# EAGLE design Nixie Uhr (EAGLE 6.1)
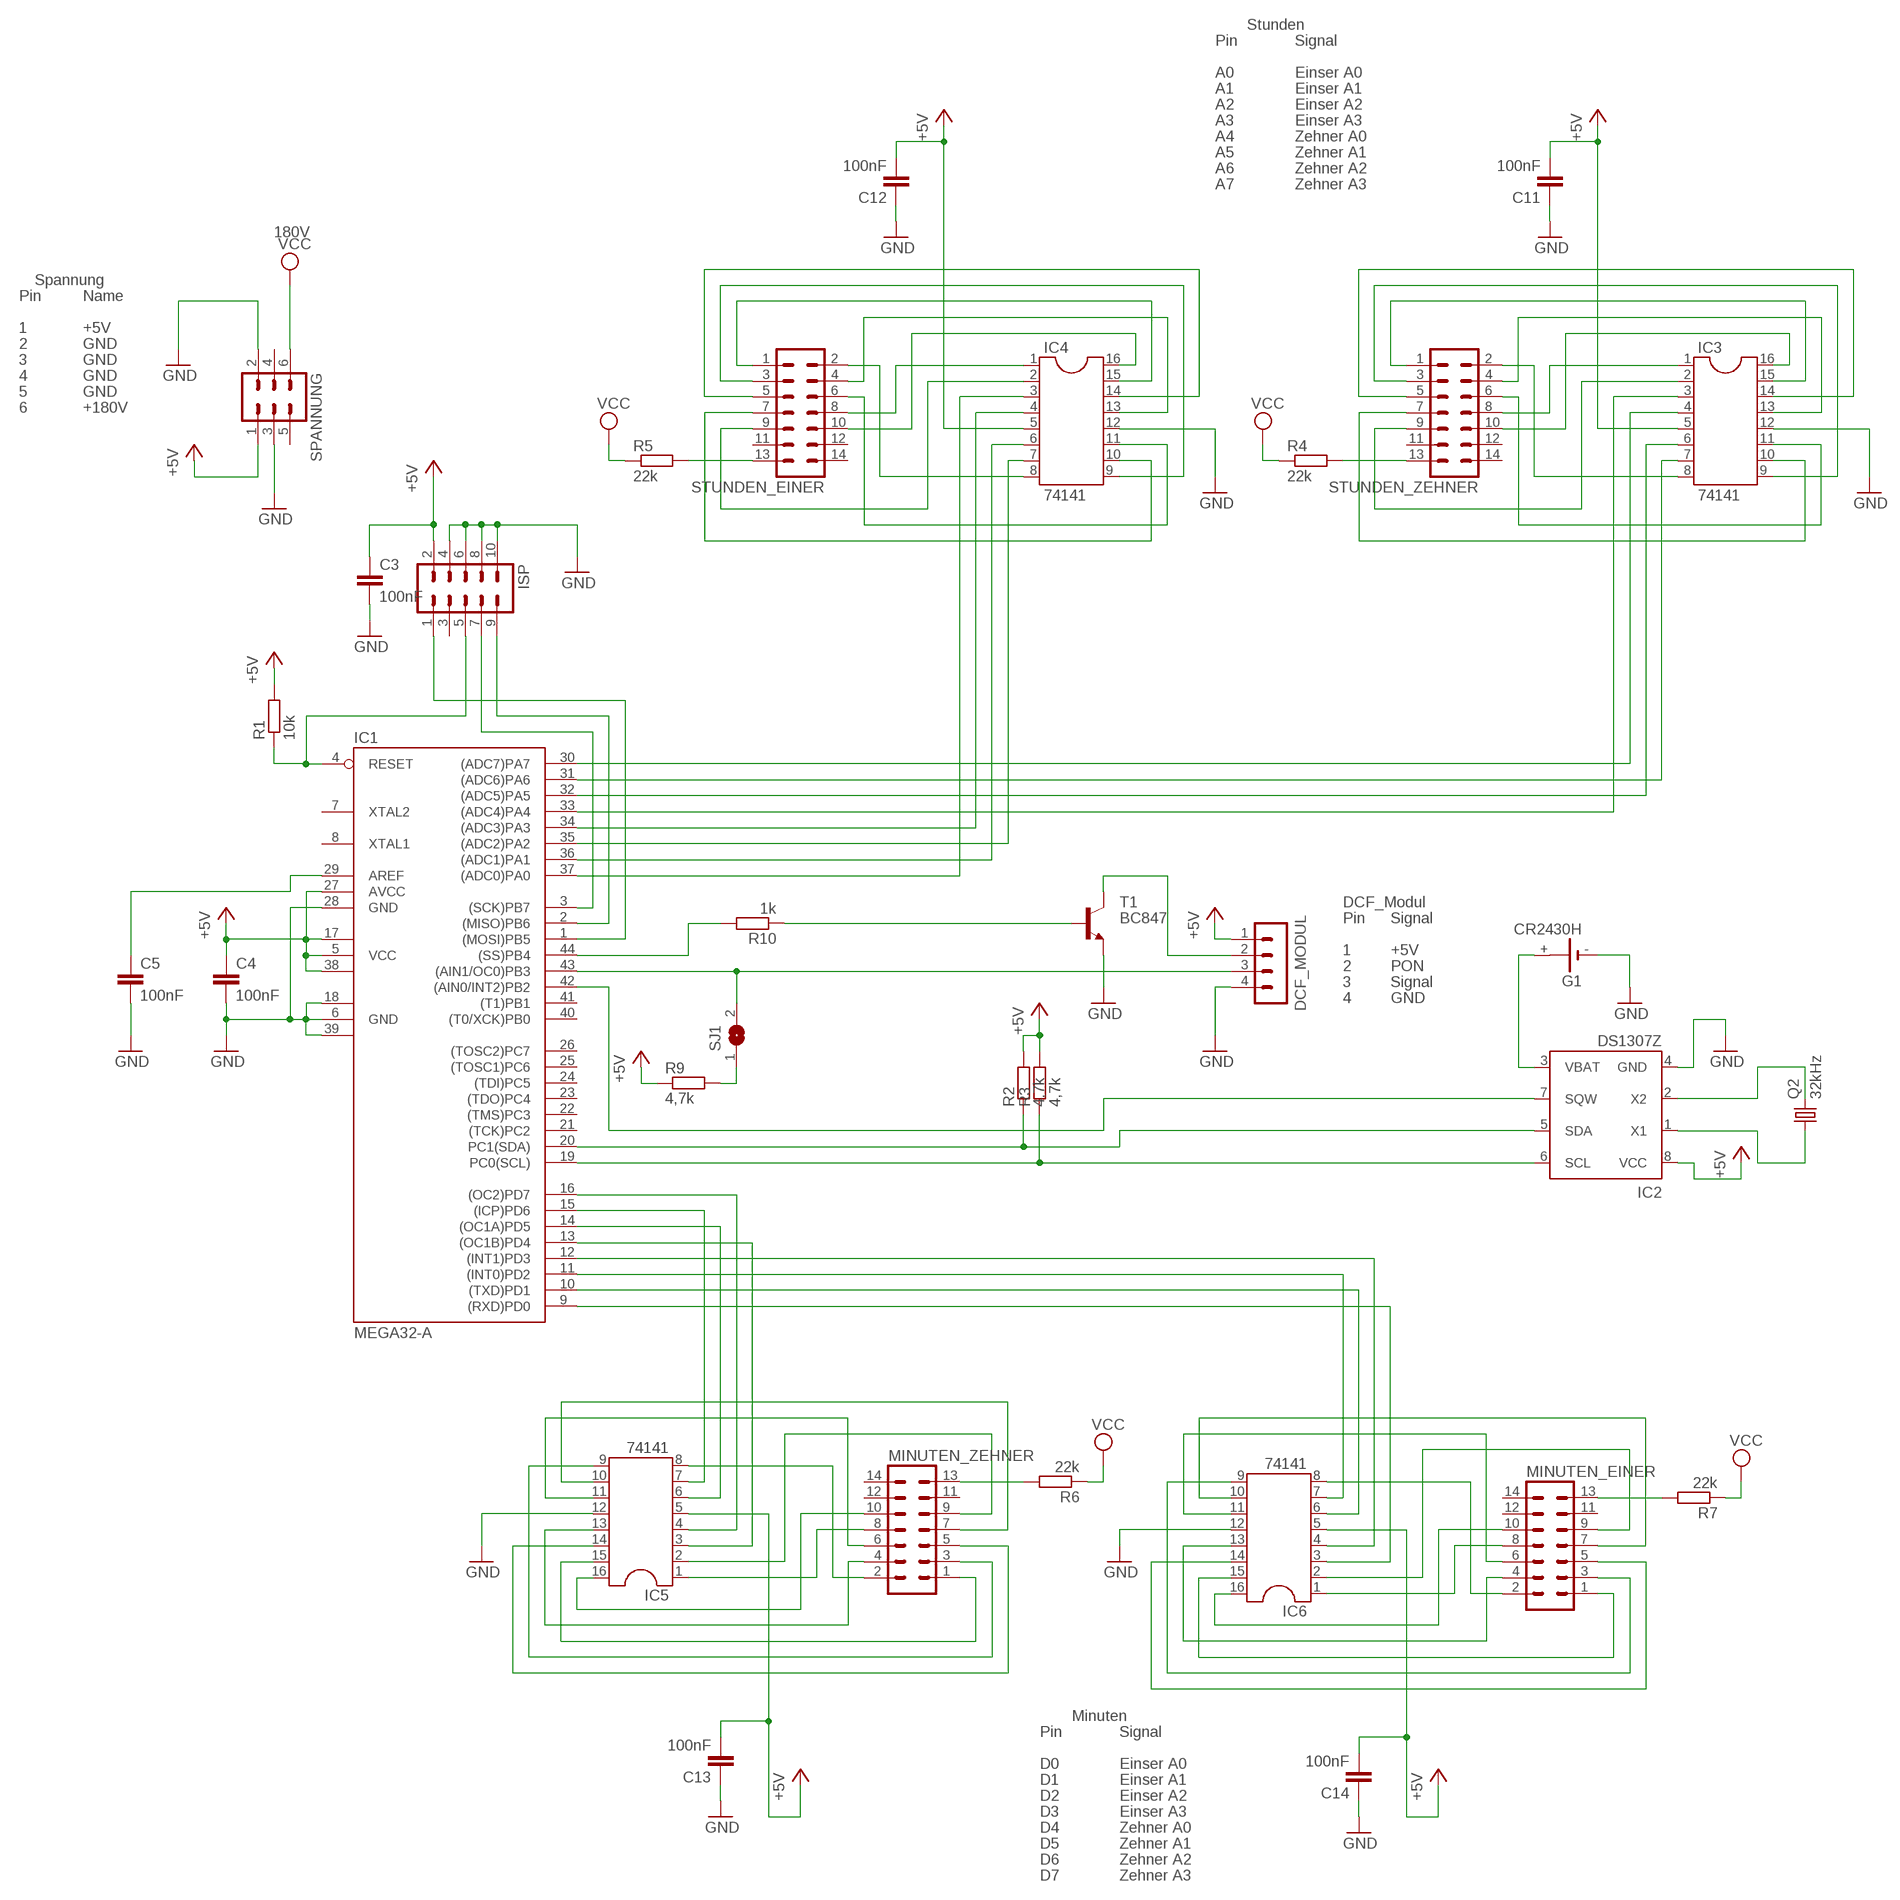
[diagram p0: schematic, sheet 1]

## Parts
C3  100nF  C-EUC0805  [C0805]
C4  100nF  C-EUC0805  [C0805]
C5  100nF  C-EUC0805  [C0805]
C11  100nF  C-EUC0805  [C0805]
C12  100nF  C-EUC0805  [C0805]
C13  100nF  C-EUC0805  [C0805]
C14  100nF  C-EUC0805  [C0805]
DCF_MODUL  MA04-1  [MA04-1]
G1  CR2430H  [CR2430H]
IC1  MEGA32-A  [TQFP44]
IC2  DS1307Z  [SOIC8]
IC3  74141  DIL16  [DIL16]
IC4  74141  DIL16  [DIL16]
IC5  74141  DIL16  [DIL16]
IC6  74141  DIL16  [DIL16]
ISP  ML10  [ML10]
MINUTEN_EINER  ML14  [ML14]
MINUTEN_ZEHNER  ML14  [ML14]
Q2  32kHz  CRYSTALTC26V  [TC26V]
R1  10k  R-EU_R0805  [R0805]
R2  4,7k  R-EU_R0805  [R0805]
R3  4,7k  R-EU_R0805  [R0805]
R4  22k  R-EU_0204/7  [0204/7]
R5  22k  R-EU_0204/7  [0204/7]
R6  22k  R-EU_0204/7  [0204/7]
R7  22k  R-EU_0204/7  [0204/7]
R9  4,7k  R-EU_R0805  [R0805]
R10  1k  R-EU_R0805  [R0805]
SJ1  SJ  [SJ]
SPANNUNG  ML6  [ML6]
STUNDEN_EINER  ML14  [ML14]
STUNDEN_ZEHNER  ML14  [ML14]
T1  BC847  [SOT23]

## Nets
+5V: C3.1 C4.1 C11.2 C12.2 C13.2 C14.2 DCF_MODUL.1 IC1.5(VCC) IC1.17(VCC1) IC1.27(AVCC) IC1.38(VCC2) IC2.8(VCC) IC3.5 IC4.5 IC5.5 IC6.5 ISP.2 R1.2 R2.2 R3.2 R9.1 SPANNUNG.1
DCF_SIGNAL: DCF_MODUL.3 IC1.43((AIN1/OC0)PB3) SJ1.2
GND: C3.2 C4.2 C5.2 C11.1 C12.1 C13.1 C14.1 DCF_MODUL.4 G1.- IC1.6(GND) IC1.18(GND1) IC1.28(GND) IC1.39(GND2) IC2.4(GND) IC3.12 IC4.12 IC5.12 IC6.12 ISP.4 ISP.6 ISP.8 ISP.10 SPANNUNG.2 SPANNUNG.3 T1.2(E)
MINUTEN_EINSER_A0: IC1.9((RXD)PD0) IC6.3
MINUTEN_MINUTEN_A1: IC1.10((TXD)PD1) IC6.6
MINUTEN_MINUTEN_A2: IC1.11((INT0)PD2) IC6.7
MINUTEN_MINUTEN_A3: IC1.12((INT1)PD3) IC6.4
MINUTEN_ZEHNER_A0: IC1.13((OC1B)PD4) IC5.3
MINUTEN_ZEHNER_A1: IC1.14((OC1A)PD5) IC5.6
MINUTEN_ZEHNER_A2: IC1.15((ICP)PD6) IC5.7
MINUTEN_ZEHNER_A3: IC1.16((OC2)PD7) IC5.4
MISO: IC1.2((MISO)PB6) ISP.9
MOSI: IC1.1((MOSI)PB5) ISP.1
N$3: IC3.15 STUNDEN_ZEHNER.1
N$4: R4.2 STUNDEN_ZEHNER.13
N$5: G1.+ IC2.3(VBAT)
N$6: IC1.42((AIN0/INT2)PB2) IC2.7(SQW)
N$7: IC2.2(X2) Q2.2
N$8: IC3.9 STUNDEN_ZEHNER.3
N$9: IC3.8 STUNDEN_ZEHNER.2
N$10: IC3.13 STUNDEN_ZEHNER.4
N$11: IC3.14 STUNDEN_ZEHNER.5
N$12: IC3.11 STUNDEN_ZEHNER.6
N$13: IC3.10 STUNDEN_ZEHNER.7
N$14: IC3.1 STUNDEN_ZEHNER.8
N$15: IC3.2 STUNDEN_ZEHNER.9
N$16: IC3.16 STUNDEN_ZEHNER.10
N$17: R5.2 STUNDEN_EINER.13
N$19: R9.2 SJ1.1
N$21: IC1.44((SS)PB4) R10.2
N$22: IC4.15 STUNDEN_EINER.1
N$23: IC4.9 STUNDEN_EINER.3
N$24: IC4.8 STUNDEN_EINER.2
N$25: IC4.13 STUNDEN_EINER.4
N$26: IC4.14 STUNDEN_EINER.5
N$27: IC4.11 STUNDEN_EINER.6
N$28: IC4.10 STUNDEN_EINER.7
N$29: IC4.1 STUNDEN_EINER.8
N$30: IC4.2 STUNDEN_EINER.9
N$31: IC4.16 STUNDEN_EINER.10
N$32: R10.1 T1.1(B)
N$33: C5.1 IC1.29(AREF)
N$34: DCF_MODUL.2 T1.3(C)
N$36: MINUTEN_ZEHNER.13 R6.2
N$37: IC5.15 MINUTEN_ZEHNER.1
N$38: IC5.9 MINUTEN_ZEHNER.3
N$39: IC5.8 MINUTEN_ZEHNER.2
N$40: IC5.13 MINUTEN_ZEHNER.4
N$41: IC5.14 MINUTEN_ZEHNER.5
N$42: IC5.11 MINUTEN_ZEHNER.6
N$43: IC5.10 MINUTEN_ZEHNER.7
N$44: IC5.1 MINUTEN_ZEHNER.8
N$45: IC5.2 MINUTEN_ZEHNER.9
N$46: IC5.16 MINUTEN_ZEHNER.10
N$51: MINUTEN_EINER.13 R7.2
N$52: IC6.15 MINUTEN_EINER.1
N$53: IC6.9 MINUTEN_EINER.3
N$54: IC6.8 MINUTEN_EINER.2
N$55: IC6.13 MINUTEN_EINER.4
N$56: IC6.14 MINUTEN_EINER.5
N$57: IC6.11 MINUTEN_EINER.6
N$58: IC6.10 MINUTEN_EINER.7
N$59: IC6.1 MINUTEN_EINER.8
N$60: IC6.2 MINUTEN_EINER.9
N$61: IC6.16 MINUTEN_EINER.10
N$66: IC2.1(X1) Q2.1
RESET: IC1.4(RESET) ISP.5 R1.1
SCK: IC1.3((SCK)PB7) ISP.7
SCL: IC1.19(PC0(SCL)) IC2.6(SCL) R3.1
SDA: IC1.20(PC1(SDA)) IC2.5(SDA) R2.1
STUNDEN_EINER_A0: IC1.37((ADC0)PA0) IC4.3
STUNDEN_EINER_A1: IC1.36((ADC1)PA1) IC4.6
STUNDEN_EINER_A2: IC1.35((ADC2)PA2) IC4.7
STUNDEN_EINER_A3: IC1.34((ADC3)PA3) IC4.4
STUNDEN_ZEHNER_A0: IC1.33((ADC4)PA4) IC3.3
STUNDEN_ZEHNER_A1: IC1.32((ADC5)PA5) IC3.6
STUNDEN_ZEHNER_A2: IC1.31((ADC6)PA6) IC3.7
STUNDEN_ZEHNER_A3: IC1.30((ADC7)PA7) IC3.4
VCC: R4.1 R5.1 R6.1 R7.1 SPANNUNG.6
Unconnected: G1.+@1(+) IC1.7(XTAL2) IC1.8(XTAL1) IC1.21((TCK)PC2) IC1.22((TMS)PC3) IC1.23((TDO)PC4) IC1.24((TDI)PC5) IC1.25((TOSC1)PC6) IC1.26((TOSC2)PC7) IC1.40((T0/XCK)PB0) IC1.41((T1)PB1) ISP.3 MINUTEN_EINER.11 MINUTEN_EINER.12 MINUTEN_EINER.14 MINUTEN_ZEHNER.11 MINUTEN_ZEHNER.12 MINUTEN_ZEHNER.14 SPANNUNG.4 SPANNUNG.5 STUNDEN_EINER.11 STUNDEN_EINER.12 STUNDEN_EINER.14 STUNDEN_ZEHNER.11 STUNDEN_ZEHNER.12 STUNDEN_ZEHNER.14

## Notes on the sheet
- Stunden
- Pin | Signal
- A0 | Einser A0
- A1 | Einser A1
- A2 | Einser A2
- A3 | Einser A3
- A4 | Zehner A0
- A5 | Zehner A1
- A6 | Zehner A2
- A7 | Zehner A3
- 180V
- Spannung
- Pin | Name
- 1 | +5V
- 2 | GND
- 3 | GND
- 4 | GND
- 5 | GND
- 6 | +180V
- DCF_Modul
- Pin | Signal
- 1 | +5V
- 2 | PON
- 3 | Signal
- 4 | GND
- Minuten
- Pin | Signal
- D0 | Einser A0
- D1 | Einser A1
- D2 | Einser A2
- D3 | Einser A3
- D4 | Zehner A0
- D5 | Zehner A1
- D6 | Zehner A2
- D7 | Zehner A3

## Library data of the parts
C3-C5 C11-C14 = rcl:C-EU: CAPACITOR, European symbol
DCF_MODUL = con-lstb:MA04-1: PIN HEADER; OC_FARNELL: unknown; OC_NEWARK: unknown
G1 = battery:CR2430H: LI BATTERY Varta
IC1 = atmel:MEGA32: MICROCONTROLLER 32 Kbytes FLASH 2 Kbytes SRAM 1 Kbytes EEPROM USART 8-channel 10 bit ADC Source: www.atmel.com .. doc2503.pdf; MPN: ATMEGA32-16AU; OC_FARNELL: 9171274; OC_NEWARK: 69K6677
IC2 = ds1307_pcf8583:DS1307: I2C-Bus CLOCK/CALENDAR
IC3-IC6 = ic-package:DIL16: Dual In Line / Socket
ISP = con-harting-ml:ML10: HARTING; OC_FARNELL: unknown; OC_NEWARK: unknown
MINUTEN_EINER MINUTEN_ZEHNER STUNDEN_EINER STUNDEN_ZEHNER = con-harting-ml:ML14: HARTING; OC_FARNELL: unknown; OC_NEWARK: unknown
Q2 = crystal:CRYSTAL: CRYSTAL; OC_FARNELL: unknown; OC_NEWARK: unknown
R1-R7 R9 R10 = rcl:R-EU_: RESISTOR, European symbol
SJ1 = jumper:SJ: SMD solder JUMPER
SPANNUNG = con-harting-ml:ML6: HARTING; OC_FARNELL: unknown; OC_NEWARK: unknown
T1 = transistor:BC847: NPN TRANSISTOR

## Board
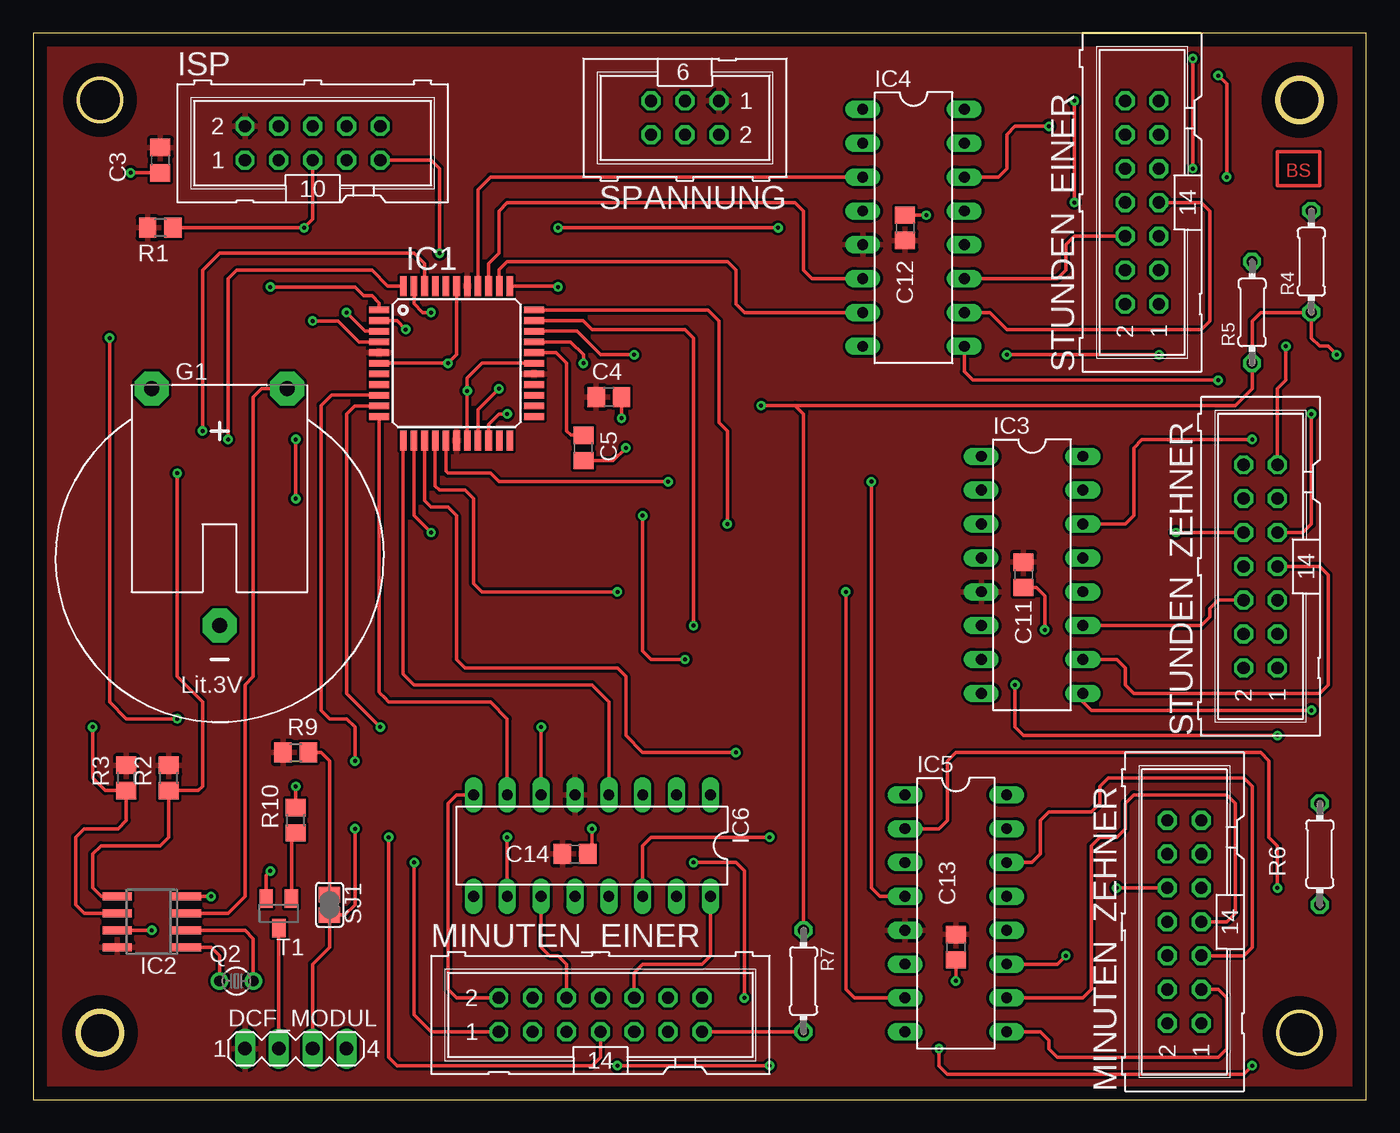
[diagram p1: board, top side]
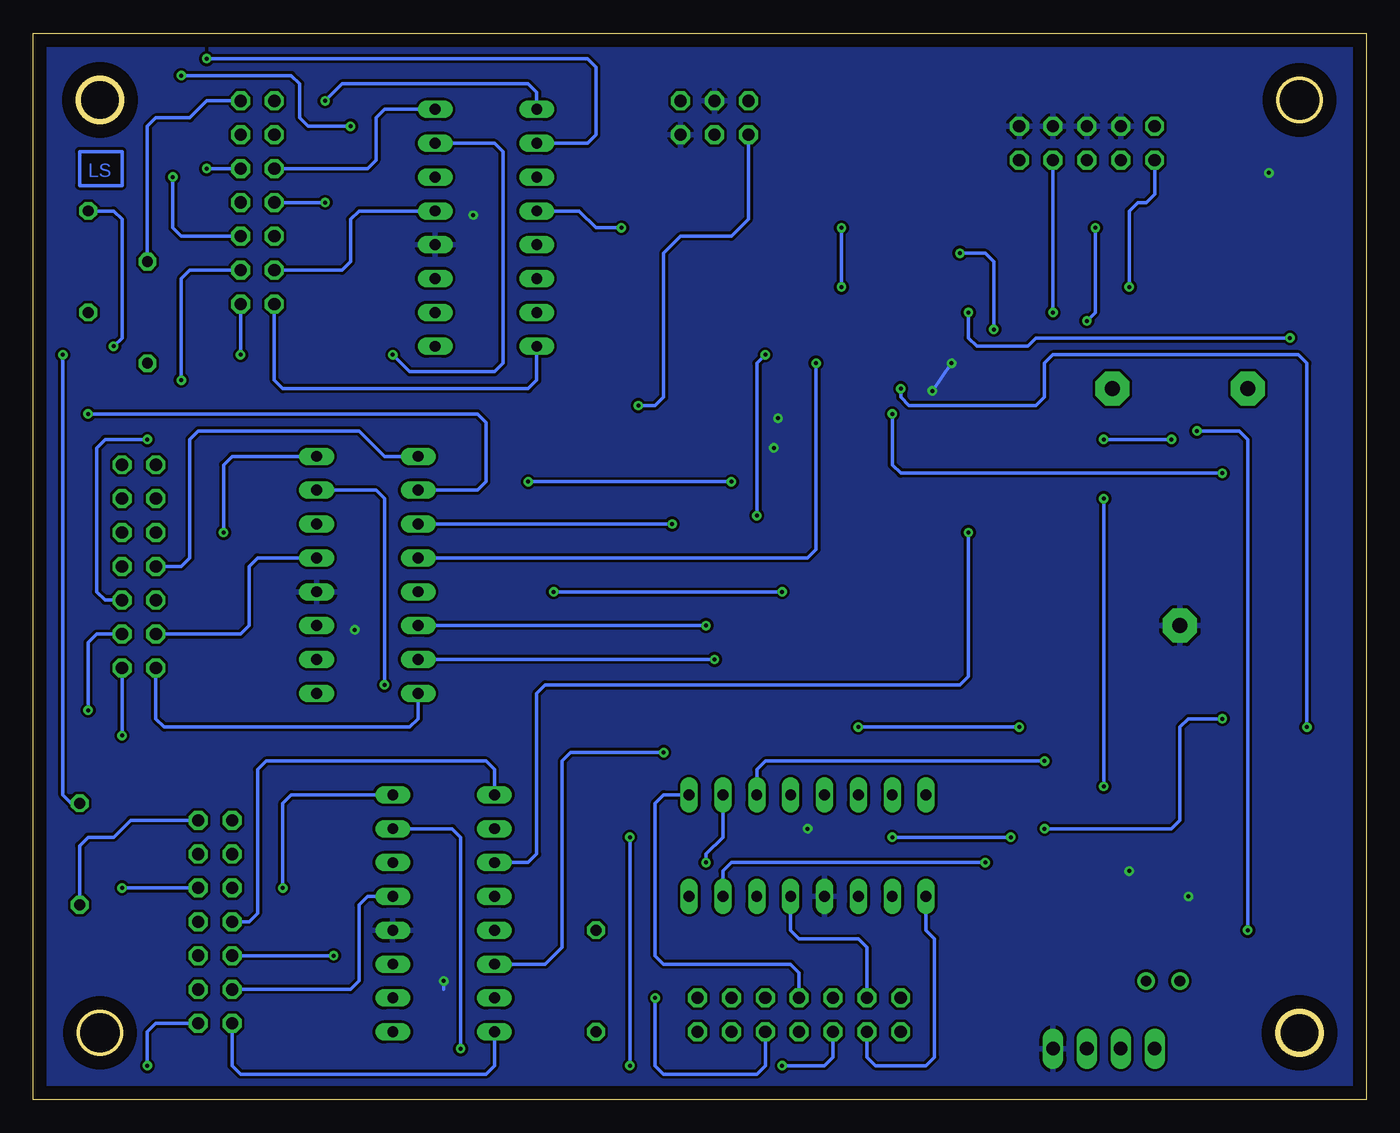
[diagram p2: board, bottom side, seen from below]

Size 100 x 80 mm. Coordinates in mm from the lower left corner, seen from the top.
Outline: 0,0 100,0 100,80 0,80 0,0
Outline: circle at 95,5 radius 1.6
Outline: circle at 5,75 radius 1.6
Outline: circle at 95,75 radius 1.6
Outline: circle at 5,5 radius 1.6
Copper layers (1*16): Top 0.035mm / dielectric 1.5mm / Bottom 0.035mm
Design rules: minimum track width 10mil, minimum drill 24mil, track to track 8mil, track to pad 8mil, pad to pad 8mil, via to via 8mil, smd to smd 8mil, copper to edge 40mil, drill to drill 8mil, minimum pad ring 10mil, minimum via ring 8mil, stop-mask expansion 4mil, vias tented up to drill 0mil, thermal gap 10mil

### Footprints (pad centres in the part's own frame; a part is rotated, then mirrored left to right if it is on the bottom)
C0805 = smd 1.3 x 1.5: 1 -0.95,0; 2 0.95,0
MA04-1 = drill 1.016 long: 1 -3.81,0; 2 -1.27,0; 3 1.27,0; 4 3.81,0
CR2430H = drill 1.118 pad 2.54 octagon: + 5.08,12.7; +@1 -5.08,12.7; - 0,-5.08
TQFP44 = smd 1.5 x 0.5: 1 -5.8,4; 2 -5.8,3.2; 3 -5.8,2.4; 4 -5.8,1.6; 5 -5.8,0.8; 6 -5.8,0; 7 -5.8,-0.8; 8 -5.8,-1.6; 9 -5.8,-2.4; 10 -5.8,-3.2; 11 -5.8,-4; 23 5.8,-4; 24 5.8,-3.2; 25 5.8,-2.4; 26 5.8,-1.6; 27 5.8,-0.8; 28 5.8,0; 29 5.8,0.8; 30 5.8,1.6; 31 5.8,2.4; 32 5.8,3.2; 33 5.8,4 | smd 0.5 x 1.5: 12 -4,-5.8; 13 -3.2,-5.8; 14 -2.4,-5.8; 15 -1.6,-5.8; 16 -0.8,-5.8; 17 0,-5.8; 18 0.8,-5.8; 19 1.6,-5.8; 20 2.4,-5.8; 21 3.2,-5.8; 22 4,-5.8; 34 4,5.8; 35 3.2,5.8; 36 2.4,5.8; 37 1.6,5.8; 38 0.8,5.8; 39 0,5.8; 40 -0.8,5.8; 41 -1.6,5.8; 42 -2.4,5.8; 43 -3.2,5.8; 44 -4,5.8
SOIC8 = smd 0.6 x 2.2: 1 -1.905,-2.6; 2 -0.635,-2.6; 3 0.635,-2.6; 4 1.905,-2.6; 5 1.905,2.6; 6 0.635,2.6; 7 -0.635,2.6; 8 -1.905,2.6
DIL16 = drill 0.813 long: 1 -8.89,-3.81; 2 -6.35,-3.81; 3 -3.81,-3.81; 4 -1.27,-3.81; 5 1.27,-3.81; 6 3.81,-3.81; 7 6.35,-3.81; 8 8.89,-3.81; 9 8.89,3.81; 10 6.35,3.81; 11 3.81,3.81; 12 1.27,3.81; 13 -1.27,3.81; 14 -3.81,3.81; 15 -6.35,3.81; 16 -8.89,3.81
ML10 = drill 0.914 octagon: 1 -5.08,-1.27; 2 -5.08,1.27; 3 -2.54,-1.27; 4 -2.54,1.27; 5 0,-1.27; 6 0,1.27; 7 2.54,-1.27; 8 2.54,1.27; 9 5.08,-1.27; 10 5.08,1.27
ML14 = drill 0.914 octagon: 1 -7.62,-1.27; 2 -7.62,1.27; 3 -5.08,-1.27; 4 -5.08,1.27; 5 -2.54,-1.27; 6 -2.54,1.27; 7 0,-1.27; 8 0,1.27; 9 2.54,-1.27; 10 2.54,1.27; 11 5.08,-1.27; 12 5.08,1.27; 13 7.62,-1.27; 14 7.62,1.27
TC26V = drill 0.813: 1 -1.27,0; 2 1.27,0
R0805 = smd 1.3 x 1.5: 1 -0.95,0; 2 0.95,0
0204/7 = drill 0.813 octagon: 1 -3.81,0; 2 3.81,0
SJ = smd 1.168 x 1.6: 1 -0.762,0; 2 0.762,0
ML6 = drill 0.914 octagon: 1 -2.54,-1.27; 2 -2.54,1.27; 3 0,-1.27; 4 0,1.27; 5 2.54,-1.27; 6 2.54,1.27
SOT23 = smd 1 x 1.4: 1 -0.95,-1.1; 2 0.95,-1.1; 3 0,1.1

### Placement (x,y rotation side)
C3  9.53,70.48 270 top
C4  43.18,52.7 0 top
C5  41.27,48.9 270 top
C11  74.3,39.37 90 top
C12  65.41,65.41 270 top
C13  69.22,11.43 90 top
C14  40.64,18.41 180 top
DCF_MODUL  19.68,3.81 0 top
G1  13.97,40.64 0 top
IC1  31.75,55.24 0 top
IC2  8.89,13.34 90 top
IC3  74.93,39.37 270 top
IC4  66.04,65.41 270 top
IC5  69.22,13.97 270 top
IC6  41.91,19.05 180 top
ISP  20.95,71.75 0 top
MINUTEN_EINER  42.55,6.35 0 top
MINUTEN_ZEHNER  86.36,13.34 90 top
Q2  15.24,8.89 0 top
R1  9.53,65.41 180 top
R2  10.16,24.13 90 top
R3  6.99,24.13 90 top
R4  95.89,62.87 90 top
R5  91.44,59.05 90 top
R6  96.52,18.41 270 top
R7  57.78,8.89 270 top
R9  19.68,26.04 0 top
R10  19.68,20.95 90 top
SJ1  22.23,14.61 270 top
SPANNUNG  48.9,73.66 180 top
STUNDEN_EINER  83.19,67.31 90 top
STUNDEN_ZEHNER  92.08,40.01 90 top
T1  18.41,13.97 180 top

### Tracks (layer width: path | path; a pad name or v marks a point on that pad's centre or on a via)
+5V
  pour Top: -10.16,91.44 110.49,91.44 110.49,-15.24 -10.16,-15.24
DCF_SIGNAL  (via drill 0.3)
  Top 0.254: DCF_MODUL.3 20.95,10.16 22.23,11.43 SJ1.2 | SJ1.2 22.23,13.97 | IC1.43 28.55,59.72 29.21,59.05 v29.84,59.05 | v5.71,57.15 5.71,29.84 6.99,28.57 v10.79,28.57 | v24.13,20.32 24.13,14.61 23.37,13.84 SJ1.2
  Bottom 0.254: v29.84,59.05 29.84,57.15 29.21,56.52 25.4,56.52 24.77,57.15 v5.71,57.15 | v24.13,20.32 14.61,20.32 13.97,20.95 13.97,27.94 13.34,28.57 v10.79,28.57
GND  (via drill 0.3)
  Top 0.254: IC1.39 31.75,55.88 v31.11,55.24 IC1.6 25.4,55.24 | IC1.18 v32.55,53.17 32.55,54.14 33.66,55.24 IC1.28 | C3.2 v7.3,69.53 | C12.1 v67,66.36 | C11.1 75.25,38.42 75.89,37.78 v75.89,35.24 | C5.2 43.5,47.95 v44.45,48.9 | C4.2 v44.13,51.12 | C13.1 v69.22,8.89 | T1.2 17.46,16.82 v17.78,17.14 | IC2.4 v13.34,15.24 | v41.91,20.32 41.91,18.41
  Top 0.406: C14.1 41.91,18.41
  Bottom 0.254: v32.55,53.17 v31.11,55.24 | v69.22,8.89 69.22,8.26
  pour Bottom: -8.89,87.63 109.22,87.63 109.22,-12.7 -8.89,-12.7
MINUTEN_EINSER_A0  (via drill 0.3)
  Top 0.254: IC1.9 22.36,52.84 21.59,52.07 21.59,29.21 22.23,28.57 23.5,28.57 24.13,27.94 v24.13,25.4
  Bottom 0.254: v24.13,25.4 45.09,25.4 45.72,24.77 IC6.3
MINUTEN_MINUTEN_A1  (via drill 0.3)
  Top 0.254: IC1.10 24.11,52.05 23.5,51.44 23.5,30.48 v26.04,27.94 | v38.1,27.94 IC6.6
  Bottom 0.254: v26.04,27.94 v38.1,27.94
MINUTEN_MINUTEN_A2
  Top 0.254: IC6.7 35.56,28.57 34.29,29.84 26.67,29.84 26.35,30.16 26.04,30.48 25.95,30.57 IC1.11
MINUTEN_MINUTEN_A3
  Top 0.254: IC6.4 43.18,29.84 41.91,31.11 28.57,31.11 27.75,31.94 IC1.12
MINUTEN_ZEHNER_A0  (via drill 0.3)
  Top 0.254: v29.84,42.55 28.57,43.81 28.57,49.53
  Top 0.406: 28.57,49.53 28.55,49.53 IC1.13
  Bottom 0.254: IC5.3 62.87,17.78 62.23,18.41 62.23,30.48 61.59,31.11 30.48,31.11 29.84,31.75 v29.84,42.55
MINUTEN_ZEHNER_A1  (via drill 0.3)
  Top 0.254: IC1.14 29.35,44.95 29.84,44.45 31.11,44.45 31.75,43.81 31.75,33.02 32.38,32.38 43.81,32.38 44.45,31.75 44.45,27.3 45.72,26.04 v52.7,26.04
  Bottom 0.254: v52.7,26.04 59.69,26.04 60.33,25.4 60.33,11.43 61.59,10.16 IC5.6
MINUTEN_ZEHNER_A2  (via drill 0.3)
  Top 0.254: IC5.7 61.59,7.62 60.96,8.26 v60.96,38.1 | v43.81,38.1 33.66,38.1 33.02,38.73 33.02,45.09 32.38,45.72 30.48,45.72 30.15,46.05 IC1.15
  Bottom 0.254: v60.96,38.1 v43.81,38.1
MINUTEN_ZEHNER_A3  (via drill 0.3)
  Top 0.254: IC5.4 63.5,15.24 62.87,15.88 v62.87,46.35 | IC1.16 30.95,47.16 31.11,46.99 34.29,46.99 34.92,46.35 v47.62,46.35
  Bottom 0.254: v62.87,46.35 v47.62,46.35
MISO  (via drill 0.3)
  Top 0.254: IC1.2 27.28,58.45 v27.94,57.78 | v30.48,63.5 30.48,69.85 29.84,70.48 ISP.9
  Bottom 0.254: v27.94,57.78 27.94,62.87 28.57,63.5 v30.48,63.5
MOSI  (via drill 0.3)
  Top 0.254: IC1.1 25.95,59.77 25.4,60.33 24.77,60.33 24.13,60.96 v17.78,60.96
  Bottom 0.254: v17.78,60.96 17.78,66.67 17.14,67.31 16.51,67.31 15.88,67.94 ISP.1
N$3  (via drill 0.3)
  Top 0.254: v93.34,27.3 74.3,27.3 73.66,27.94 v73.66,31.11
  Bottom 0.254: v73.66,31.11 73.66,45.09 74.3,45.72 IC3.15 | v93.34,27.3 STUNDEN_ZEHNER.1
N$4  (via drill 0.3)
  Top 0.254: v93.98,56.52 93.98,53.98 93.34,53.34 STUNDEN_ZEHNER.13
  Bottom 0.254: R4.2 93.98,66.67 93.34,66.04 93.34,57.15 v93.98,56.52
N$5
  Top 0.254: IC2.3 14.61,13.97 15.88,15.24 15.88,31.11 16.51,31.75 16.51,52.7 17.14,53.34 G1.+
N$6  (via drill 0.3)
  Top 0.254: IC2.7 v8.89,12.7 | v12.7,50.16 12.7,62.23 13.97,63.5 28.57,63.5 29.35,62.73 IC1.42
  Bottom 0.254: v8.89,12.7 8.89,49.53 9.53,50.16 v12.7,50.16
N$7
  Top 0.254: IC2.2 15.88,12.7 16.51,12.06 Q2.2
N$8  (via drill 0.3)
  Top 0.254: IC3.9 78.74,29.84 79.38,29.21 v95.89,29.21
  Bottom 0.254: v95.89,29.21 95.89,34.29 95.25,34.92 STUNDEN_ZEHNER.3
N$9
  Bottom 0.254: IC3.8 71.12,28.57 71.75,27.94 90.17,27.94 90.81,28.57 STUNDEN_ZEHNER.2
N$10
  Bottom 0.254: STUNDEN_ZEHNER.4 84.45,34.92 83.82,35.56 83.82,40.01 83.19,40.64 IC3.13
N$11  (via drill 0.3)
  Top 0.254: IC3.14 81.92,43.18 82.55,43.81 82.55,48.9 83.19,49.53 v91.44,49.53
  Bottom 0.254: v91.44,49.53 94.61,49.53 95.25,48.9 95.25,38.1 94.61,37.47 STUNDEN_ZEHNER.5
N$12
  Top 0.254: IC3.11 87.63,35.56 88.27,36.2 88.27,36.83 88.9,37.47 STUNDEN_ZEHNER.6
N$13
  Top 0.254: IC3.10 81.28,33.02 81.92,32.38 81.92,31.11 82.55,30.48 96.52,30.48 97.16,31.11 97.16,39.37 96.52,40.01 STUNDEN_ZEHNER.7
N$14
  Bottom 0.254: IC3.1 73.66,48.26 75.56,50.16 87.63,50.16 88.27,49.53 88.27,40.64 88.9,40.01 STUNDEN_ZEHNER.8
N$15  (via drill 0.3)
  Top 0.254: v95.89,51.44 95.89,43.18 95.25,42.55 STUNDEN_ZEHNER.9
  Bottom 0.254: IC3.2 66.67,45.72 66.04,46.35 66.04,50.8 66.67,51.44 v95.89,51.44
N$16  (via drill 0.3)
  Top 0.254: v85.72,42.55 STUNDEN_ZEHNER.10
  Bottom 0.254: IC3.16 85.09,48.26 85.72,47.62 v85.72,42.55
N$17
  Bottom 0.254: STUNDEN_EINER.13 87,74.93 88.27,73.66 90.81,73.66 91.44,73.03 R5.2
N$18
  Top 0.254: 93.34,71.12 96.52,71.12 96.52,68.58 93.34,68.58 93.34,71.12
N$19
  Top 0.254: R9.2 21.59,26.04 22.23,25.4 SJ1.1
  Top 0.406: 22.23,15.24 SJ1.1
N$20
  Bottom 0.254: 93.34,71.12 96.52,71.12 96.52,68.58 93.34,68.58 93.34,71.12
N$21  (via drill 0.3)
  Top 0.254: R10.2 v19.68,23.5 | v19.68,45.09 v19.68,49.53 | v14.61,49.53 14.61,61.59 15.24,62.23 25.4,62.23 26.59,61.05 IC1.44
  Bottom 0.254: v19.68,23.5 v19.68,45.09 | v19.68,49.53 v14.61,49.53
N$22  (via drill 0.3)
  Top 0.254: v84.45,55.88 v73.03,55.88
  Bottom 0.254: STUNDEN_EINER.1 v84.45,55.88 | v73.03,55.88 71.75,54.61 65.41,54.61 64.77,55.24 64.77,71.12 65.41,71.75 IC4.15
N$23  (via drill 0.3)
  Top 0.254: IC4.9 69.85,54.61 70.48,53.98 v88.9,53.98
  Bottom 0.254: v88.9,53.98 88.9,61.59 88.27,62.23 STUNDEN_EINER.3
N$24
  Bottom 0.254: IC4.8 62.23,53.98 62.87,53.34 81.28,53.34 81.92,53.98 STUNDEN_EINER.2
N$25
  Bottom 0.254: IC4.13 75.56,66.67 76.2,66.04 76.2,62.87 76.83,62.23 STUNDEN_EINER.4
N$26  (via drill 0.3)
  Top 0.254: IC4.14 72.39,69.22 73.03,69.85 73.03,72.39 73.66,73.03 v76.2,73.03 | v88.9,76.83 89.53,76.2 v89.53,69.22
  Bottom 0.254: v76.2,73.03 79.38,73.03 80.01,73.66 80.01,76.2 80.64,76.83 v88.9,76.83 | STUNDEN_EINER.5 88.9,64.77 89.53,65.41 v89.53,69.22
N$27
  Top 0.254: IC4.11 76.83,61.59 77.47,62.23 77.47,64.14 78.11,64.77 STUNDEN_EINER.6
N$28
  Top 0.254: IC4.10 71.75,59.05 73.03,57.78 87.63,57.78 88.27,58.42 88.27,66.67 87.63,67.31 STUNDEN_EINER.7
N$29  (via drill 0.3)
  Top 0.254: v78.11,74.93 v78.11,67.31
  Bottom 0.254: IC4.1 62.23,75.56 62.87,76.2 76.83,76.2 v78.11,74.93 | v78.11,67.31 STUNDEN_EINER.8
N$30  (via drill 0.3)
  Top 0.254: v87,78.11 v87,69.85
  Bottom 0.254: IC4.2 58.42,71.75 57.78,72.39 57.78,77.47 58.42,78.11 v87,78.11 | v87,69.85 STUNDEN_EINER.9
N$31
  Bottom 0.254: IC4.16 73.66,74.3 74.3,73.66 74.3,70.48 74.93,69.85 STUNDEN_EINER.10
N$32
  Top 0.254: T1.1 19.36,19.69 R10.1
N$33
  Top 0.254: IC1.29 39.2,56.05 40.01,55.24 40.01,50.16 40.33,49.84 C5.1
N$34
  Top 0.254: T1.3 DCF_MODUL.2
N$36
  Bottom 0.254: MINUTEN_ZEHNER.13 92.71,20.95 93.98,19.68 95.89,19.68 96.52,19.05 R6.2
N$37  (via drill 0.3)
  Top 0.254: v91.44,2.54 90.81,1.91 68.58,1.91 67.94,2.54 v67.94,3.81
  Bottom 0.254: IC5.15 68.58,20.32 67.94,19.68 v67.94,3.81 | v91.44,2.54 91.44,5.08 90.81,5.71 MINUTEN_ZEHNER.1
N$38
  Top 0.254: IC5.9 75.56,5.08 76.2,4.45 76.2,3.81 76.83,3.17 88.9,3.17 89.53,3.81 89.53,7.62 88.9,8.26 MINUTEN_ZEHNER.3
N$39
  Bottom 0.254: IC5.8 65.41,2.54 66.04,1.91 84.45,1.91 85.09,2.54 MINUTEN_ZEHNER.2
N$40
  Bottom 0.254: IC5.13 74.93,15.24 75.56,14.61 75.56,8.89 76.2,8.26 MINUTEN_ZEHNER.4
N$41
  Top 0.254: IC5.14 74.93,17.78 75.56,18.41 75.56,20.95 76.2,21.59 79.38,21.59 80.01,22.23 80.01,23.5 80.64,24.13 90.81,24.13 91.44,23.5 91.44,11.43 90.81,10.79 MINUTEN_ZEHNER.5
N$42  (via drill 0.3)
  Top 0.254: IC5.11 76.83,10.16 v77.47,10.79
  Bottom 0.254: v77.47,10.79 MINUTEN_ZEHNER.6
N$43
  Top 0.254: IC5.10 78.74,7.62 79.38,8.26 79.38,19.05 80.01,19.68 81.28,19.68 81.92,20.32 81.92,22.23 82.55,22.86 89.53,22.86 90.17,22.23 90.17,13.97 89.53,13.34 MINUTEN_ZEHNER.7
N$44
  Bottom 0.254: IC5.1 65.41,24.77 66.04,25.4 82.55,25.4 83.19,24.77 83.19,13.97 83.82,13.34 MINUTEN_ZEHNER.8
N$45  (via drill 0.3)
  Top 0.254: v93.34,15.88 93.34,19.05 92.71,19.68 92.71,25.4 92.08,26.04 69.22,26.04 68.58,25.4 68.58,20.95 67.94,20.32 IC5.2
  Bottom 0.254: v93.34,15.88 MINUTEN_ZEHNER.9
N$46  (via drill 0.3)
  Top 0.254: v81.28,15.88 MINUTEN_ZEHNER.10
  Bottom 0.254: v81.28,15.88 81.28,22.23 80.64,22.86 IC5.16
N$51
  Top 0.254: R7.2 MINUTEN_EINER.13
N$52  (via drill 0.3)
  Top 0.254: MINUTEN_EINER.1 29.84,5.08 28.57,6.35 v28.57,17.78
  Bottom 0.254: v28.57,17.78 47.62,17.78 48.26,17.14 IC6.15
N$53
  Bottom 0.254: MINUTEN_EINER.3 37.47,3.17 36.83,2.54 33.02,2.54 32.38,3.17 32.38,12.06 33.02,12.7 IC6.9
N$54
  Top 0.254: MINUTEN_EINER.2 31.75,7.62 31.11,8.26 31.11,22.23 31.75,22.86 IC6.8
N$55
  Bottom 0.254: IC6.13 43.18,12.7 42.55,12.06 38.1,12.06 37.47,11.43 MINUTEN_EINER.4
N$56  (via drill 0.3)
  Top 0.254: v43.81,2.54 v55.24,2.54 | v55.24,19.68 46.35,19.68 45.72,19.05 IC6.14
  Bottom 0.254: MINUTEN_EINER.5 40.01,3.17 40.64,2.54 v43.81,2.54 | v55.24,2.54 v55.24,19.68
N$57
  Top 0.254: IC6.11 38.1,11.43 38.73,10.79 39.37,10.79 40.01,10.16 MINUTEN_EINER.6
N$58  (via drill 0.3)
  Top 0.254: IC6.10 v35.56,19.68 | v26.67,19.68 26.67,3.17 27.3,2.54 41.91,2.54 42.55,3.17 MINUTEN_EINER.7
  Bottom 0.254: v35.56,19.68 v26.67,19.68
N$59
  Bottom 0.254: MINUTEN_EINER.8 42.55,9.53 43.18,10.16 52.7,10.16 53.34,10.79 53.34,22.23 52.7,22.86 IC6.1
N$60  (via drill 0.3)
  Top 0.254: v53.34,7.62 53.34,17.14 52.7,17.78 v49.53,17.78
  Bottom 0.254: MINUTEN_EINER.9 45.09,2.54 45.72,1.91 52.7,1.91 53.34,2.54 v53.34,7.62 | v49.53,17.78 49.53,18.41 48.26,19.68 IC6.2
N$61
  Top 0.254: MINUTEN_EINER.10 45.09,9.53 45.72,10.16 50.16,10.16 50.8,10.79 IC6.16
N$66
  Top 0.254: IC2.1 13.34,11.43 13.97,10.79 Q2.1
RESET  (via drill 0.3)
  Top 0.254: R1.1 v20.32,65.41 20.95,66.04 ISP.5 | v20.95,58.42 22.86,58.42 24.43,56.84 IC1.4
  Bottom 0.254: v20.32,65.41 20.32,59.05 v20.95,58.42
SCK  (via drill 0.3)
  Top 0.254: IC1.3 24.91,57.65 v23.5,59.05
  Bottom 0.254: v23.5,59.05 ISP.7
SCL  (via drill 0.3)
  Top 0.254: IC2.6 3.81,13.97 3.17,14.61 3.17,19.68 3.81,20.32 6.35,20.32 6.99,20.95 R3.1 | R3.1 6.99,23.5 | R3.1 5.39,23.18 4.45,24.13 v4.45,27.94 | v34.92,53.34 33.35,51.77 IC1.19
  Bottom 0.254: v4.45,27.94 4.45,55.24 5.08,55.88 23.5,55.88 24.13,55.24 24.13,52.7 24.77,52.07 34.29,52.07 34.92,52.7 v34.92,53.34
SDA  (via drill 0.3)
  Top 0.254: IC2.5 5.08,15.24 4.45,15.88 4.45,18.41 5.08,19.05 9.53,19.05 10.16,19.68 R2.1 12.38,23.18 12.7,23.5 12.7,29.84 10.79,31.75 v10.79,46.99 | v35.56,51.44 34.92,51.44 34.15,50.66 IC1.20
  Bottom 0.254: v10.79,46.99 34.92,46.99 35.56,47.62 v35.56,51.44
STUNDEN_EINER_A0
  Top 0.254: IC1.37 33.35,68.28 34.29,69.22 IC4.3
STUNDEN_EINER_A1
  Top 0.254: IC1.36 34.15,62.73 34.92,63.5 34.92,66.67 35.56,67.31 57.15,67.31 57.78,66.67 57.78,62.23 58.42,61.59 IC4.6
STUNDEN_EINER_A2
  Top 0.254: IC1.35 34.95,62.26 35.56,62.87 52.07,62.87 52.7,62.23 52.7,59.69 53.34,59.05 IC4.7
STUNDEN_EINER_A3  (via drill 0.3)
  Top 0.254: v39.37,65.41 v55.88,65.41 | IC1.34 39.28,61.05 v39.37,60.96
  Bottom 0.254: v39.37,60.96 v39.37,65.41 | v55.88,65.41 57.78,65.41 59.05,66.67 IC4.4
STUNDEN_ZEHNER_A0  (via drill 0.3)
  Top 0.254: IC1.33 50.61,59.24 51.44,58.42 51.44,50.8 52.07,50.16 v52.07,43.18
  Bottom 0.254: v52.07,43.18 IC3.3
STUNDEN_ZEHNER_A1  (via drill 0.3)
  Top 0.254: IC1.32 41.25,58.45 41.91,57.78 48.9,57.78 49.53,57.15 v49.53,35.56
  Bottom 0.254: v49.53,35.56 IC3.6
STUNDEN_ZEHNER_A2  (via drill 0.3)
  Top 0.254: IC1.31 40.78,57.65 42.55,55.88 v45.09,55.88 | v45.72,43.81 45.72,33.66 46.35,33.02 v48.9,33.02
  Bottom 0.254: v45.09,55.88 45.72,55.24 v45.72,43.81 | v48.9,33.02 IC3.7
STUNDEN_ZEHNER_A3  (via drill 0.3)
  Top 0.254: IC1.30 40.31,56.84 41.27,55.88 v41.27,55.24
  Bottom 0.254: v41.27,55.24 41.27,41.27 41.91,40.64 IC3.4
VCC  (via drill 0.3)
  Top 0.254: v97.79,55.88 97.16,56.52 96.52,56.52 95.89,57.15 R4.1 92.08,59.05 91.44,58.42 R5.1 91.44,53.34 90.17,52.07 57.15,52.07 | v54.61,52.07 57.15,52.07 | R7.1 57.78,51.44 57.15,52.07
  Bottom 0.254: v97.79,55.88 97.79,22.86 97.16,22.23 R6.1 | SPANNUNG.6 46.35,66.04 47.62,64.77 51.44,64.77 52.7,63.5 52.7,52.7 53.34,52.07 v54.61,52.07

### Text on the board
Top: BS
Bottom: LS